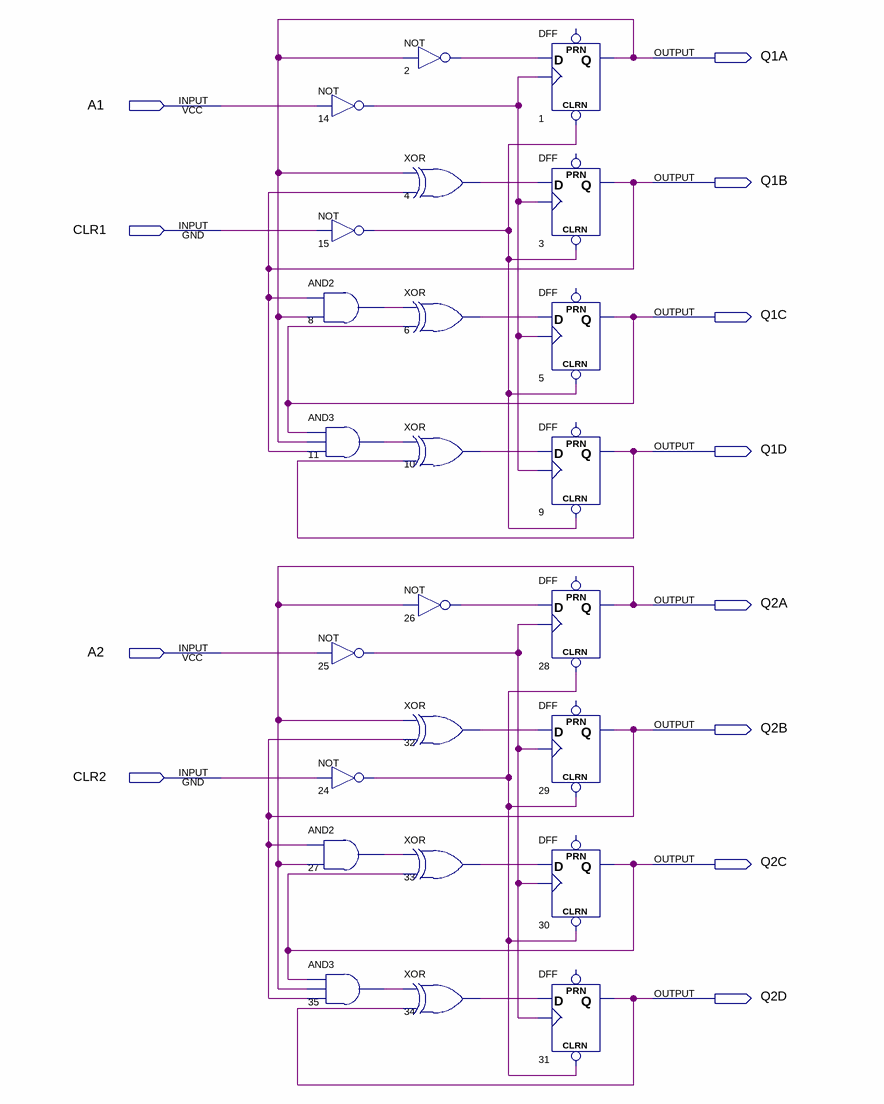
[diagram p0: schematic sheet]
// Quartus schematic SN74LS393.bdf as structural Verilog: 24 symbols, 12 pins
module SN74LS393 (
  input  A1,
  input  CLR1,
  input  A2,
  input  CLR2,
  output Q1A,
  output Q1B,
  output Q1C,
  output Q1D,
  output Q2A,
  output Q2B,
  output Q2C,
  output Q2D
);

  wire n2_out, n4_out, n6_out, n8_out, n10_out, n11_out, n14_out, n15_out, n24_out, n25_out, n26_out,
       n27_out, n32_out, n33_out, n34_out, n35_out;

  and u_8 (n8_out, Q1B, Q1A);
  and u_11 (n11_out, Q1C, Q1A, Q1B);
  and u_27 (n27_out, Q2B, Q2A);
  and u_35 (n35_out, Q2C, Q2A, Q2B);
  not u_14 (n14_out, A1);
  not u_15 (n15_out, CLR1);
  not u_25 (n25_out, A2);
  not u_24 (n24_out, CLR2);
  not u_2 (n2_out, Q1A);
  xor u_4 (n4_out, Q1A, Q1B);
  xor u_6 (n6_out, n8_out, Q1C);
  xor u_10 (n10_out, n11_out, Q1D);
  not u_26 (n26_out, Q2A);
  xor u_32 (n32_out, Q2A, Q2B);
  xor u_33 (n33_out, n27_out, Q2C);
  xor u_34 (n34_out, n35_out, Q2D);
  DFF u_1 (.CLRN(n15_out), .CLK(n14_out), .D(n2_out), .Q(Q1A));  // open: PRN
  DFF u_3 (.CLRN(n15_out), .CLK(n14_out), .D(n4_out), .Q(Q1B));  // open: PRN
  DFF u_5 (.CLRN(n15_out), .CLK(n14_out), .D(n6_out), .Q(Q1C));  // open: PRN
  DFF u_9 (.CLRN(n15_out), .CLK(n14_out), .D(n10_out), .Q(Q1D));  // open: PRN
  DFF u_28 (.CLRN(n24_out), .CLK(n25_out), .D(n26_out), .Q(Q2A));  // open: PRN
  DFF u_29 (.CLRN(n24_out), .CLK(n25_out), .D(n32_out), .Q(Q2B));  // open: PRN
  DFF u_30 (.CLRN(n24_out), .CLK(n25_out), .D(n33_out), .Q(Q2C));  // open: PRN
  DFF u_31 (.CLRN(n24_out), .CLK(n25_out), .D(n34_out), .Q(Q2D));  // open: PRN
endmodule
